# Altium schematic sheet Display.SchDoc
size B; Organization: Reclaimer Labs, LLC; Address1: 3652 Beth Ct; Address2: Santa Clara CA 95054; DocumentNumber: 3; SheetNumber: 3; SheetTotal: 3; License: Open Source Hardware - MIT License; DocumentFullName: Display
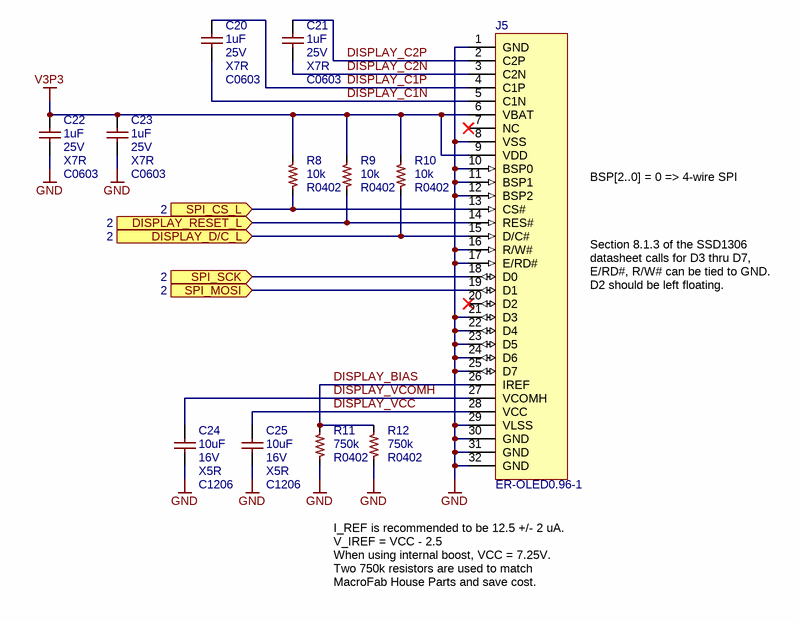
[diagram p0: Display.SchDoc]

## Parts
C20  value 1uF  Voltage: 25V  Material: X7R  [C0603]  (hidden comment: MF-CAP-0603-1uF)
C21  value 1uF  Voltage: 25V  Material: X7R  [C0603]  (hidden comment: MF-CAP-0603-1uF)
C22  value 1uF  Voltage: 25V  Material: X7R  [C0603]  (hidden comment: MF-CAP-0603-1uF)
C23  value 1uF  Voltage: 25V  Material: X7R  [C0603]  (hidden comment: MF-CAP-0603-1uF)
C24  value 10uF  Voltage: 16V  Material: X5R  [C1206]  (hidden comment: MF-CAP-1206-10uF)
C25  value 10uF  Voltage: 16V  Material: X5R  [C1206]  (hidden comment: MF-CAP-1206-10uF)
J5  value ER-OLED0.96-1  [SFV30R_Mirrored]  (hidden comment: SFV30R-3STBE1HLF)
R8  value 10k  [R0402]  (hidden comment: MF-RES-0402-10K)
R9  value 10k  [R0402]  (hidden comment: MF-RES-0402-10K)
R10  value 10k  [R0402]  (hidden comment: MF-RES-0402-10K)
R11  value 750k  [R0402]  (hidden comment: MF-RES-0402-750K)
R12  value 750k  [R0402]  (hidden comment: MF-RES-0402-750K)

## Ports
DISPLAY_D/C_L (in, see 2), DISPLAY_RESET_L (in, see 2), SPI_CS_L (in, see 2), SPI_MOSI (in, see 2), SPI_SCK (in, see 2)

## Nets
GND: C22.2(C2) C23.2(C2) C24.2(C2) C25.2(C2) J5.1(GND) J5.8(VSS) J5.10(BSP0) J5.11(BSP1) J5.12(BSP2) J5.16(R/W#) J5.17(E/RD#) J5.21(D3) J5.22(D4) J5.23(D5) J5.24(D6) J5.25(D7) J5.29(VLSS) J5.30(GND) J5.31(GND) J5.32(GND) R11.2(R2) R12.2(R2)
V3P3: C22.1(C1) C23.1(C1) J5.6(VBAT) J5.9(VDD) R8.1(R1) R9.1(R1) R10.1(R1)
DISPLAY_BIAS: J5.26(IREF) R11.1(R1) R12.1(R1)
DISPLAY_C1N: C20.2(C2) J5.5(C1N)
DISPLAY_C1P: C20.1(C1) J5.4(C1P)
DISPLAY_C2N: C21.2(C2) J5.3(C2N)
DISPLAY_C2P: C21.1(C1) J5.2(C2P)
DISPLAY_D/C_L: J5.15(D/C#) R10.2(R2) ; port DISPLAY_D/C_L
DISPLAY_RESET_L: J5.14(RES#) R9.2(R2) ; port DISPLAY_RESET_L
DISPLAY_VCC: C25.1(C1) J5.28(VCC)
DISPLAY_VCOMH: C24.1(C1) J5.27(VCOMH)
SPI_CS_L: J5.13(CS#) R8.2(R2) ; port SPI_CS_L
SPI_MOSI: J5.19(D1) ; port SPI_MOSI
SPI_SCK: J5.18(D0) ; port SPI_SCK

Not connected (* = marked no-connect by the designer): J5 7(NC)* 20(D2)*

## Notes on the sheet
- BSP[2..0] = 0 => 4-wire SPI
- Section 8.1.3 of the SSD1306 datasheet calls for D3 thru D7, E/RD#, R/W# can be tied to GND.
  D2 should be left floating.
- I_REF is recommended to be 12.5 +/- 2 uA.
  V_IREF = VCC - 2.5
  When using internal boost, VCC = 7.25V.
  Two 750k resistors are used to match MacroFab House Parts and save cost.
- Project:
- Date:
- Revision:
- Drawn By:
- Document:
- Time:
- Sheet
- of

## Library data of the parts
C20-C25 = CAPACITOR_NP: Manufacturer 1: MacroFab
  C20-C23: Manufacturer Part Number 1: MF-CAP-0603-1uF; DisplayFootprint: C0603
  C24 C25: Manufacturer Part Number 1: MF-CAP-1206-10uF; DisplayFootprint: C1206
J5 = ER-OLED0.96-1: Manufacturer 1: Amphenol FCI; Manufacturer Part Number 1: SFV30R-3STBE1HLF
R8-R12 = RESISTOR: Manufacturer 1: MacroFab; FootprintDisplay: R0402
  R8-R10: Manufacturer Part Number 1: MF-RES-0402-10K
  R11 R12: Manufacturer Part Number 1: MF-RES-0402-750K